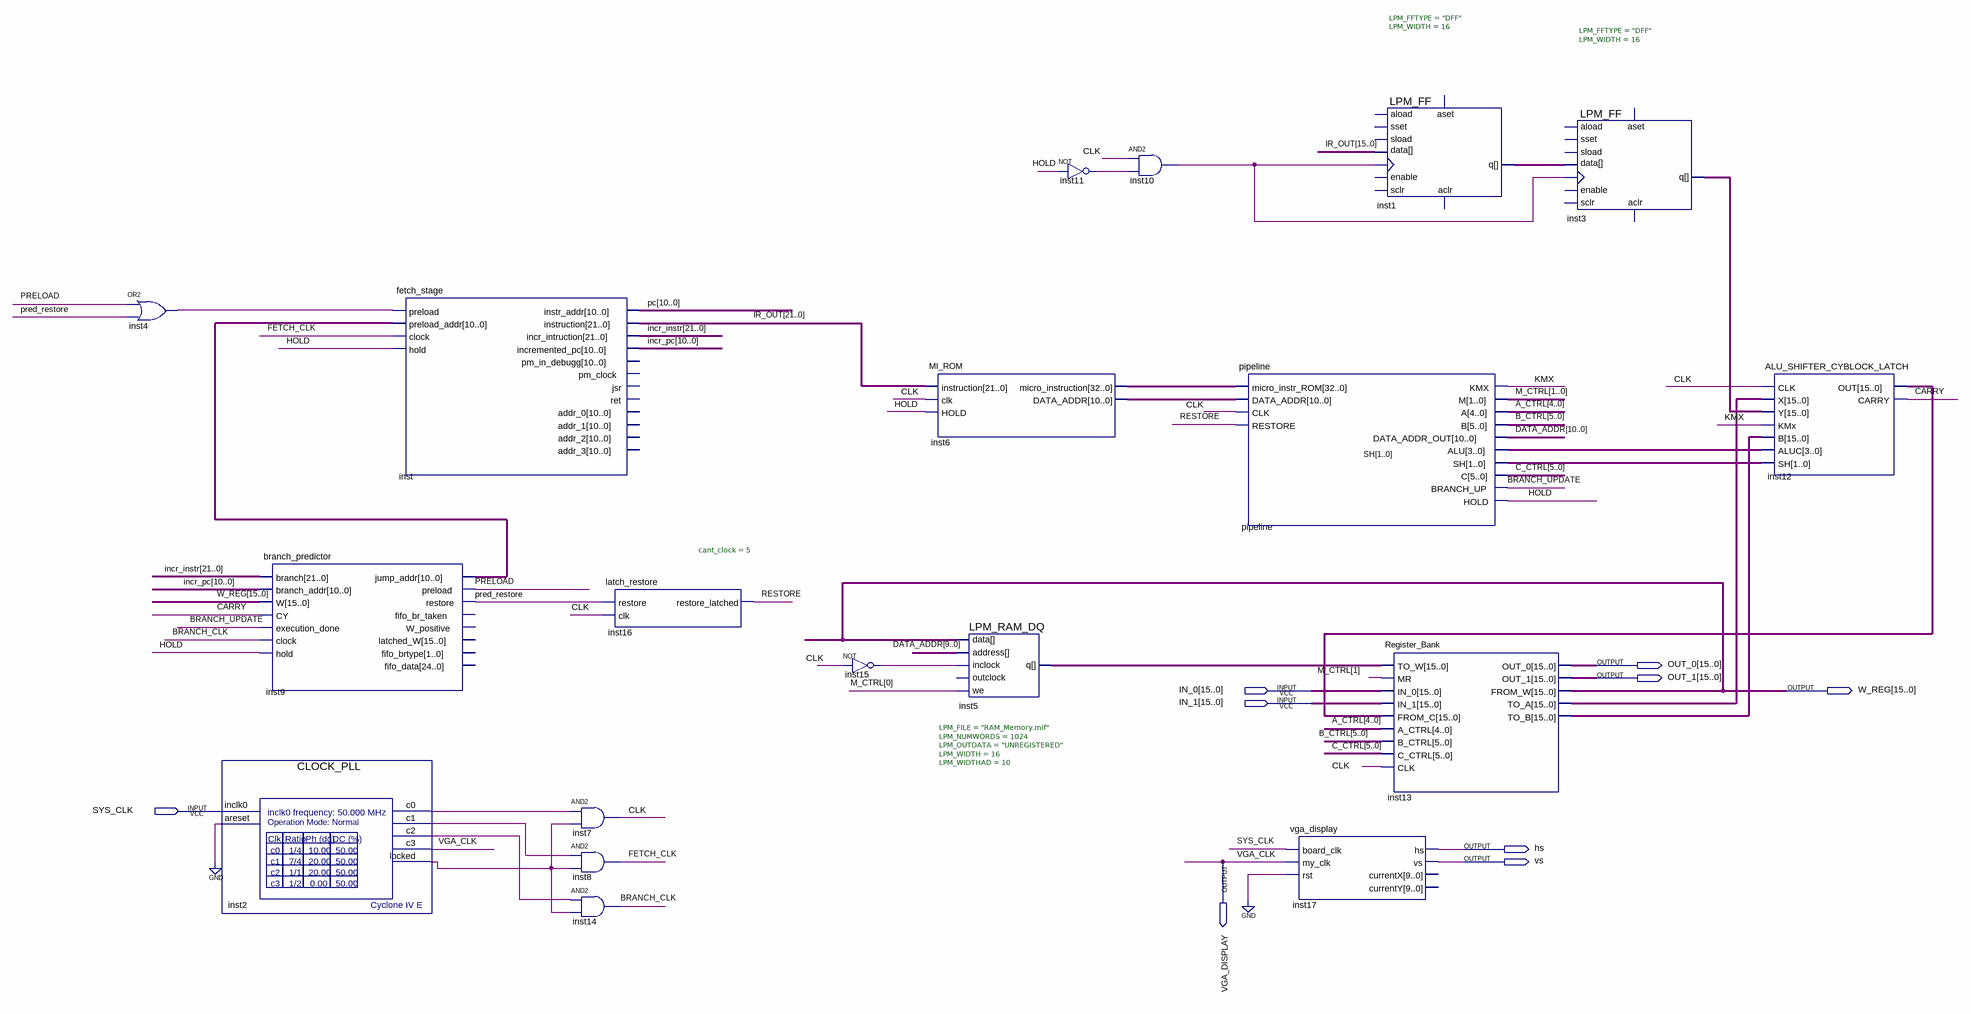
[diagram p0: schematic sheet]
// Quartus schematic TP2_EV21.bdf as structural Verilog: 19 symbols, 9 pins
module TP2_EV21 (
  input  [15:0] IN_0,
  input  [15:0] IN_1,
  input  SYS_CLK,
  output [15:0] OUT_0,
  output [15:0] OUT_1,
  output [15:0] W_REG,
  output hs,
  output VGA_DISPLAY,
  output vs
);

  wire BRANCH_CLK, BRANCH_UPDATE, CARRY, CLK, FETCH_CLK, HOLD, inst2_c0, inst2_c1, inst2_c2, inst2_locked,
       inst4_out, inst10_out, inst11_out, inst15_out, KMX, pred_restore, PRELOAD, RESTORE;
  wire [1:0] M_CTRL, SH;
  wire [3:0] pipeline_alu;
  wire [4:0] A_CTRL;
  wire [5:0] B_CTRL, C_CTRL;
  wire [10:0] DATA_ADDR, incr_pc, inst6_data_addr, inst9_jump_addr, pc;
  wire [15:0] inst1_q, inst3_q, inst5_q, inst12_out, inst13_to_a, inst13_to_b;
  wire [21:0] incr_instr, IR_OUT;
  wire [32:0] inst6_micro_instruction;

  or inst4 (inst4_out, PRELOAD, pred_restore);
  CLOCK_PLL inst2 (
    .inclk0(SYS_CLK), .areset(1'b0), .c0(inst2_c0), .c1(inst2_c1), .c2(inst2_c2), .c3(VGA_DISPLAY),
    .locked(inst2_locked));
  branch_predictor inst9 (
    .branch(incr_instr), .branch_addr(incr_pc), .W(W_REG), .CY(CARRY), .execution_done(BRANCH_UPDATE),
    .clock(BRANCH_CLK), .hold(HOLD), .jump_addr(inst9_jump_addr), .preload(PRELOAD), .restore(pred_restore));  // open: fifo_br_taken, W_positive, latched_W, fifo_brtype, fifo_data
  fetch_stage inst (
    .preload(inst4_out), .preload_addr(inst9_jump_addr), .clock(FETCH_CLK), .hold(HOLD), .instr_addr(pc),
    .instruction(IR_OUT), .incr_intruction(incr_instr), .incremented_pc(incr_pc));  // open: pm_in_debugg, pm_clock, jsr, ret, addr_0, addr_1, addr_2, addr_3
  and inst7 (CLK, inst2_c0, inst2_locked);
  and inst8 (FETCH_CLK, inst2_c1, inst2_locked);
  and inst14 (BRANCH_CLK, inst2_c2, inst2_locked);
  latch_restore #(.cant_clock(5)) inst16 (.restore(pred_restore), .clk(CLK), .restore_latched(RESTORE));
  not inst15 (inst15_out, CLK);
  MI_ROM inst6 (
    .instruction(IR_OUT), .clk(CLK), .HOLD(HOLD), .micro_instruction(inst6_micro_instruction),
    .DATA_ADDR(inst6_data_addr));
  LPM_RAM_DQ #(.LPM_FILE("RAM_Memory.mif"), .LPM_NUMWORDS(1024), .LPM_OUTDATA("UNREGISTERED"), .LPM_WIDTH(16), .LPM_WIDTHAD(10)) inst5 (
    .inclock(inst15_out), .data(W_REG), .address(DATA_ADDR[9:0]), .we(M_CTRL[0]), .q(inst5_q));  // open: outclock
  not inst11 (inst11_out, HOLD);
  and inst10 (inst10_out, CLK, inst11_out);
  pipeline pipeline (
    .micro_instr_ROM(inst6_micro_instruction), .DATA_ADDR(inst6_data_addr), .CLK(CLK), .RESTORE(RESTORE),
    .KMX(KMX), .M(M_CTRL), .A(A_CTRL), .B(B_CTRL), .DATA_ADDR_OUT(DATA_ADDR), .ALU(pipeline_alu), .SH(SH),
    .C(C_CTRL), .BRANCH_UP(BRANCH_UPDATE), .HOLD(HOLD));
  vga_display inst17 (
    .board_clk(SYS_CLK), .my_clk(VGA_DISPLAY), .rst(1'b0), .hs(hs), .vs(vs));  // open: currentX, currentY
  LPM_FF #(.LPM_FFTYPE("DFF"), .LPM_WIDTH(16)) inst1 (
    .clock(inst10_out), .data(IR_OUT[15:0]), .q(inst1_q));  // open: enable, aload, sset, sload, aset, sclr, aclr
  Register_Bank inst13 (
    .TO_W(inst5_q), .MR(M_CTRL[1]), .IN_0(IN_0), .IN_1(IN_1), .FROM_C(inst12_out), .A_CTRL(A_CTRL),
    .B_CTRL(B_CTRL), .C_CTRL(C_CTRL), .CLK(CLK), .OUT_0(OUT_0), .OUT_1(OUT_1), .FROM_W(W_REG),
    .TO_A(inst13_to_a), .TO_B(inst13_to_b));
  LPM_FF #(.LPM_FFTYPE("DFF"), .LPM_WIDTH(16)) inst3 (
    .clock(inst10_out), .data(inst1_q), .q(inst3_q));  // open: enable, aload, sset, sload, aset, sclr, aclr
  ALU_SHIFTER_CYBLOCK_LATCH inst12 (
    .CLK(CLK), .X(inst13_to_a), .Y(inst3_q), .KMx(KMX), .B(inst13_to_b), .ALUC(pipeline_alu), .SH(SH),
    .OUT(inst12_out), .CARRY(CARRY));

  // Other names for the same wires on the sheet: VGA_CLK = VGA_DISPLAY
endmodule
